# EasyEDA Pro project ProProject_工科大.epro

# Schematic power
Create Date: 2023-09-27; Page Name: P1; Project Name: New Project_2023-07-11_20-16-29; Schematic Name: Schematic7; Update Date: 2023-09-27; Company: 嘉立创EDA; Page Size: A4; Version: V1.0
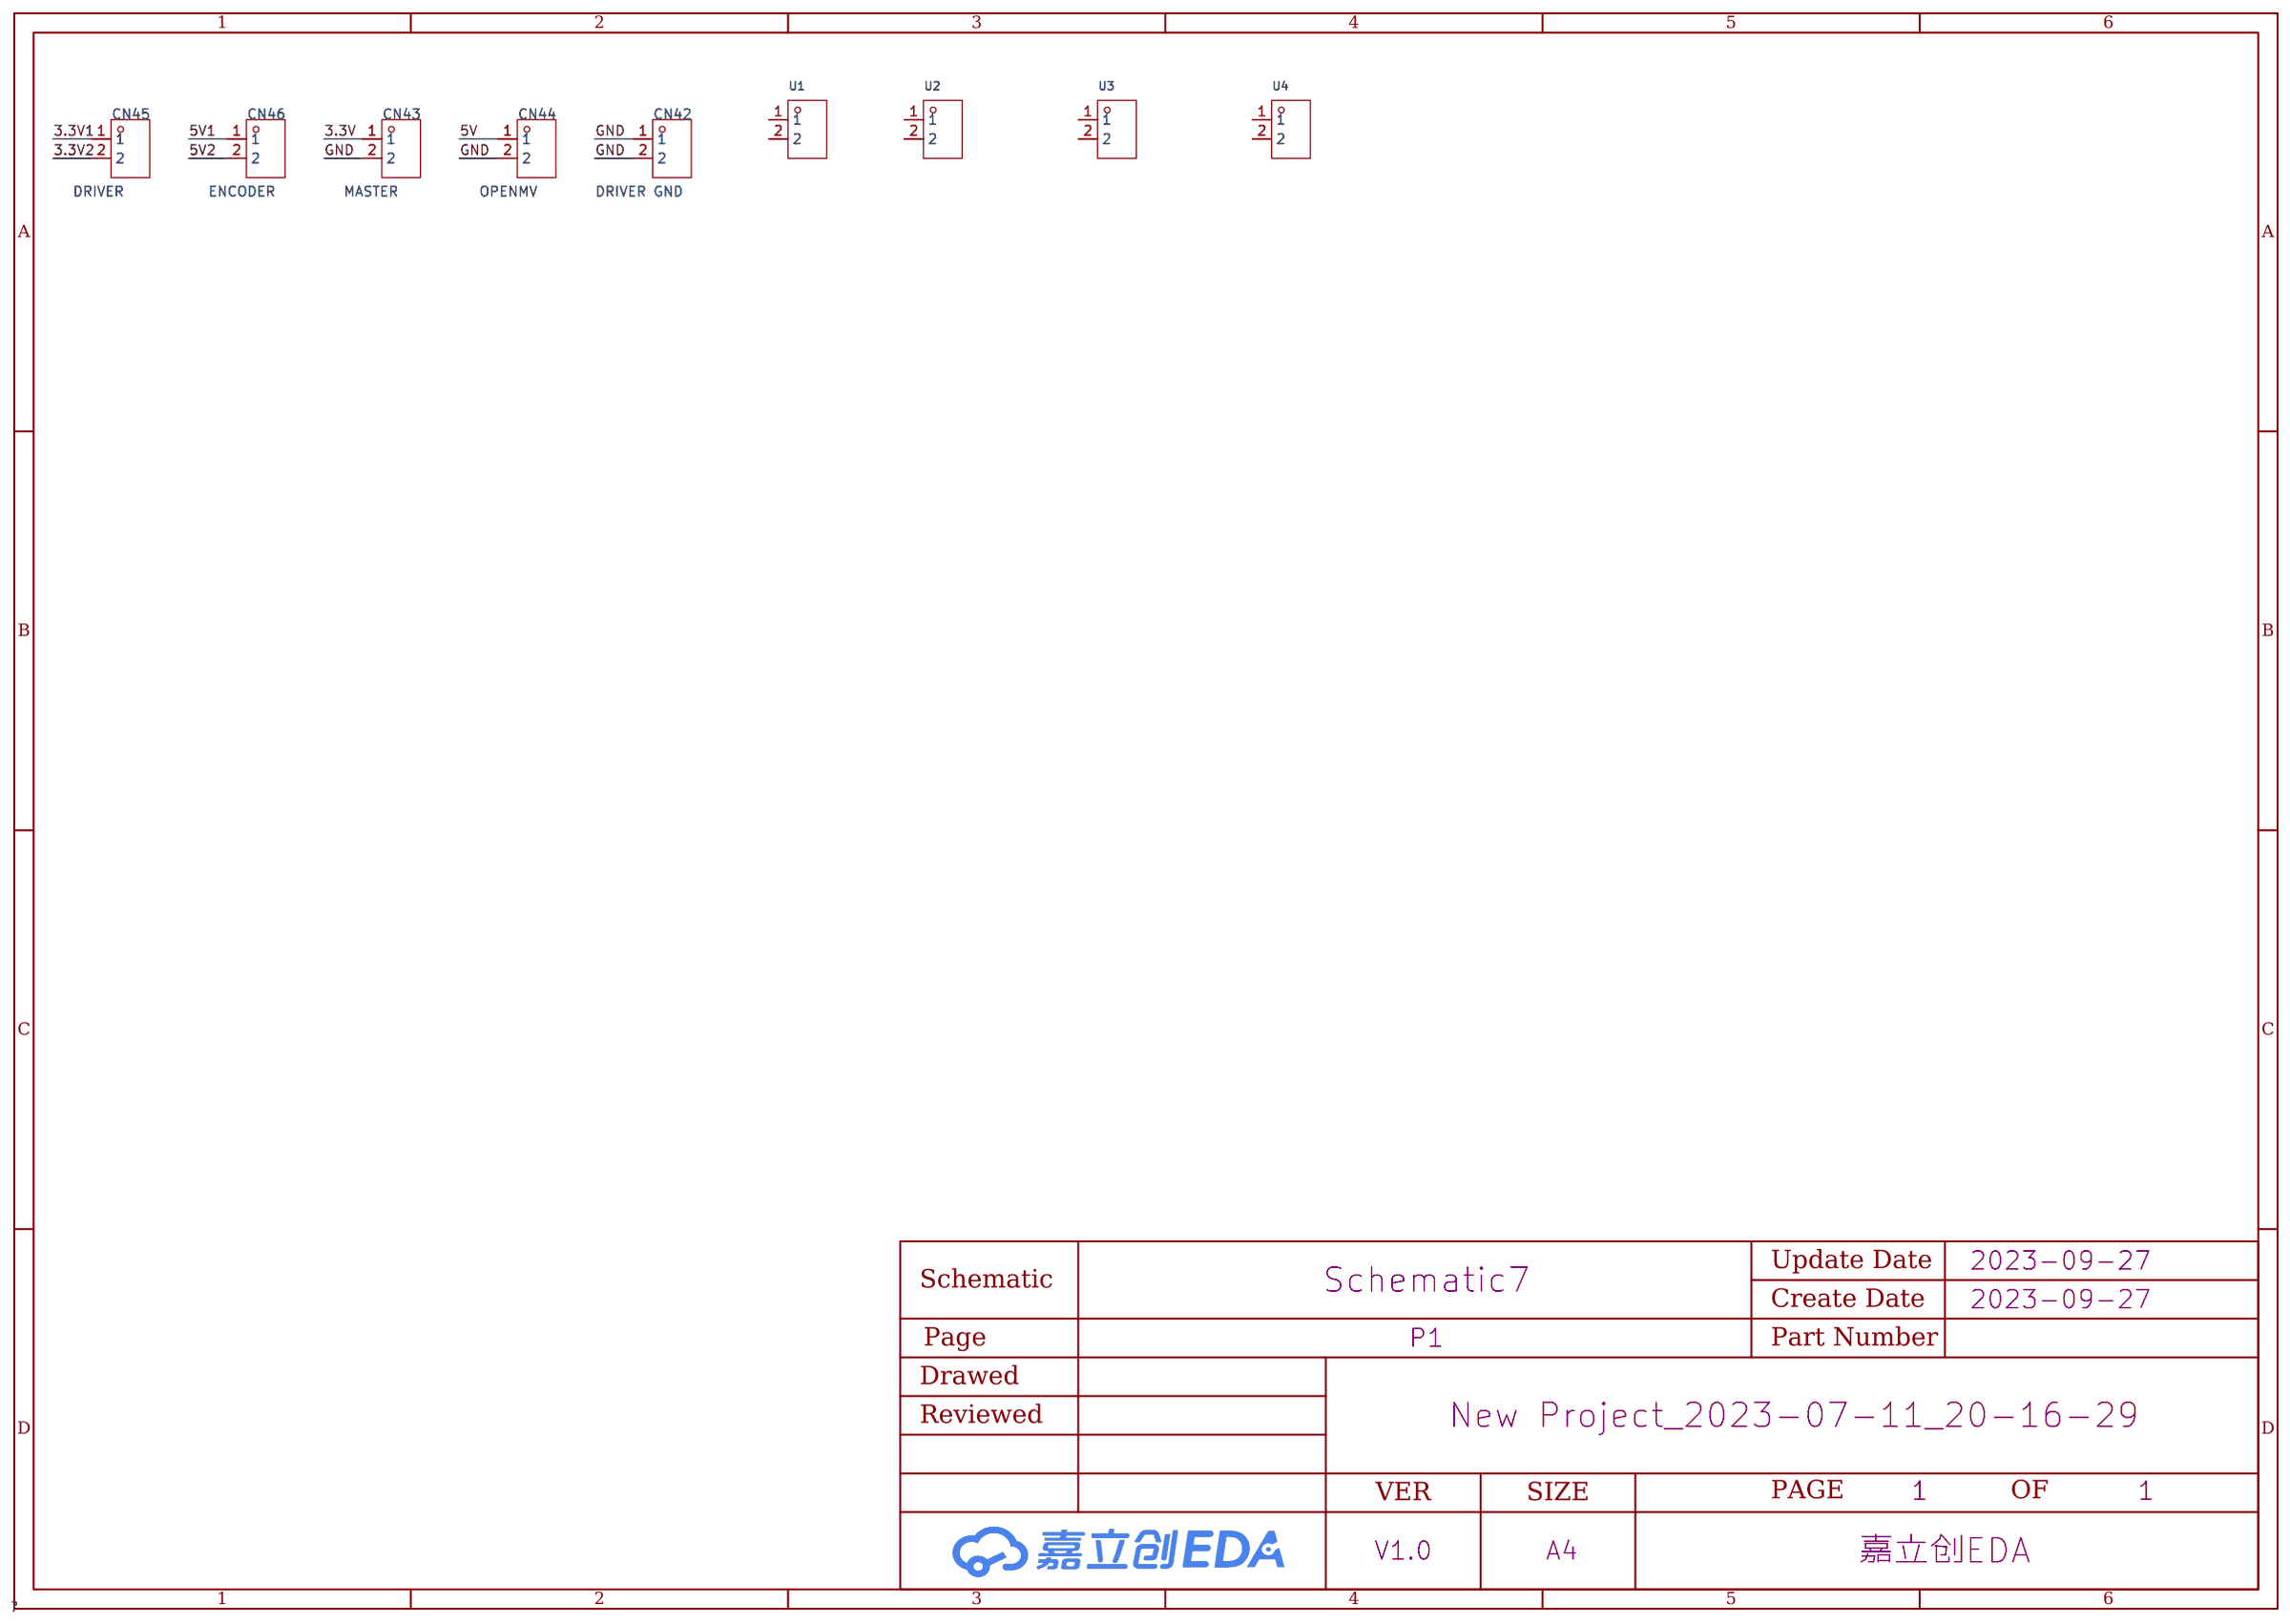
[diagram p0: schematic sheet]

## Parts
CN42  DRIVER GND  [CONN-TH_XH-2AW_C2908611]
CN43  MASTER  [CONN-TH_XH-2AW_C2908611]
CN44  OPENMV  [CONN-TH_XH-2AW_C2908611]
CN45  DRIVER  [CONN-TH_XH-2AW_C2908611]
CN46  ENCODER  [CONN-TH_XH-2AW_C2908611]
U1  PM254-1-02-Z-8.5  [HDR-TH_2P-P2.54-V-F]
U2  PM254-1-02-Z-8.5  [HDR-TH_2P-P2.54-V-F]
U3  PM254-1-02-Z-8.5  [HDR-TH_2P-P2.54-V-F]
U4  PM254-1-02-Z-8.5  [HDR-TH_2P-P2.54-V-F]

## Library data of the parts
CN42-CN46 = XH-2AW_C2908611: 参考系列:XH;间距:2.54mm;插针结构:1x2P;排数:1;每排PIN数:2;行距:-;公母:公型插针;安装方式:弯插;额定电流:3A;工作温度范围:-25℃~+85℃;; LCSC Part Name: XH 2.54mm 1x2P 弯插; Supplier Part: C2908611; Manufacturer: HCTL(华灿天禄); Supplier Footprint: 弯插,P=2.54mm; JLCPCB Part Class: 扩展库; Datasheet: https://atta.szlcsc.com/upload/public/pdf/source/20211021/ACA2D54D99493880102FCACAC8DAABA8.pdf; Supplier: LCSC; Reference Series: XH; Pitch: 2.54mm; Pins Structure: 1x2P; Number of Rows: 1; Number of PINs Per Row: 2; Gender: 公型插针; Mounting Style: 弯插; Current Rating (Max): 3A; Operating Temperature Range: -25℃~+85℃
U1-U4 = PM254-1-02-Z-8.5: 排数:单排;总孔位数:2P;间距:2.54mm;插孔结构:1x2P;行距:-;安装类型:直插;圆孔/方孔:方孔;额定电流:3A;额定电压:-;插孔方向:顶部;塑高:8.5mm;工作温度范围:-40℃~+105℃;; LCSC Part Name: 2.54mm 1x2P; Supplier Part: C2897365; Manufacturer: HCTL(华灿天禄); Supplier Footprint: 插件,P=2.54mm; JLCPCB Part Class: 扩展库; Datasheet: https://atta.szlcsc.com/upload/public/pdf/source/20230609/534BE42964C679BDE98E061007C4ABD6.pdf; Supplier: LCSC; Number of Rows: 单排; Number of Holes: 2P; Pitch: 2.54mm; Holes Structure: 1x2P; Mounting Type: 直插; Circular Hole / Square Hole: 方孔; Current Rating (Max): 3A; Holes Direction: 顶部; Insulation Height: 8.5mm; Operating Temperature Range: -40℃~+105℃

## Nets
3.3V: CN43.1
3.3V1: CN45.1
3.3V2: CN45.2
5V: CN44.1
5V1: CN46.1
5V2: CN46.2
GND: CN42.1 CN42.2 CN43.2 CN44.2

Not connected (* = marked no-connect by the designer): U1 1 2; U2 1 2; U3 1 2; U4 1 2

# Schematic driver
Create Date: 2023-09-27; Page Name: P1; Project Name: New Project_2023-07-11_20-16-29; Schematic Name: Schematic6; Update Date: 2023-09-27; Company: 嘉立创EDA; Page Size: A4; Version: V1.0
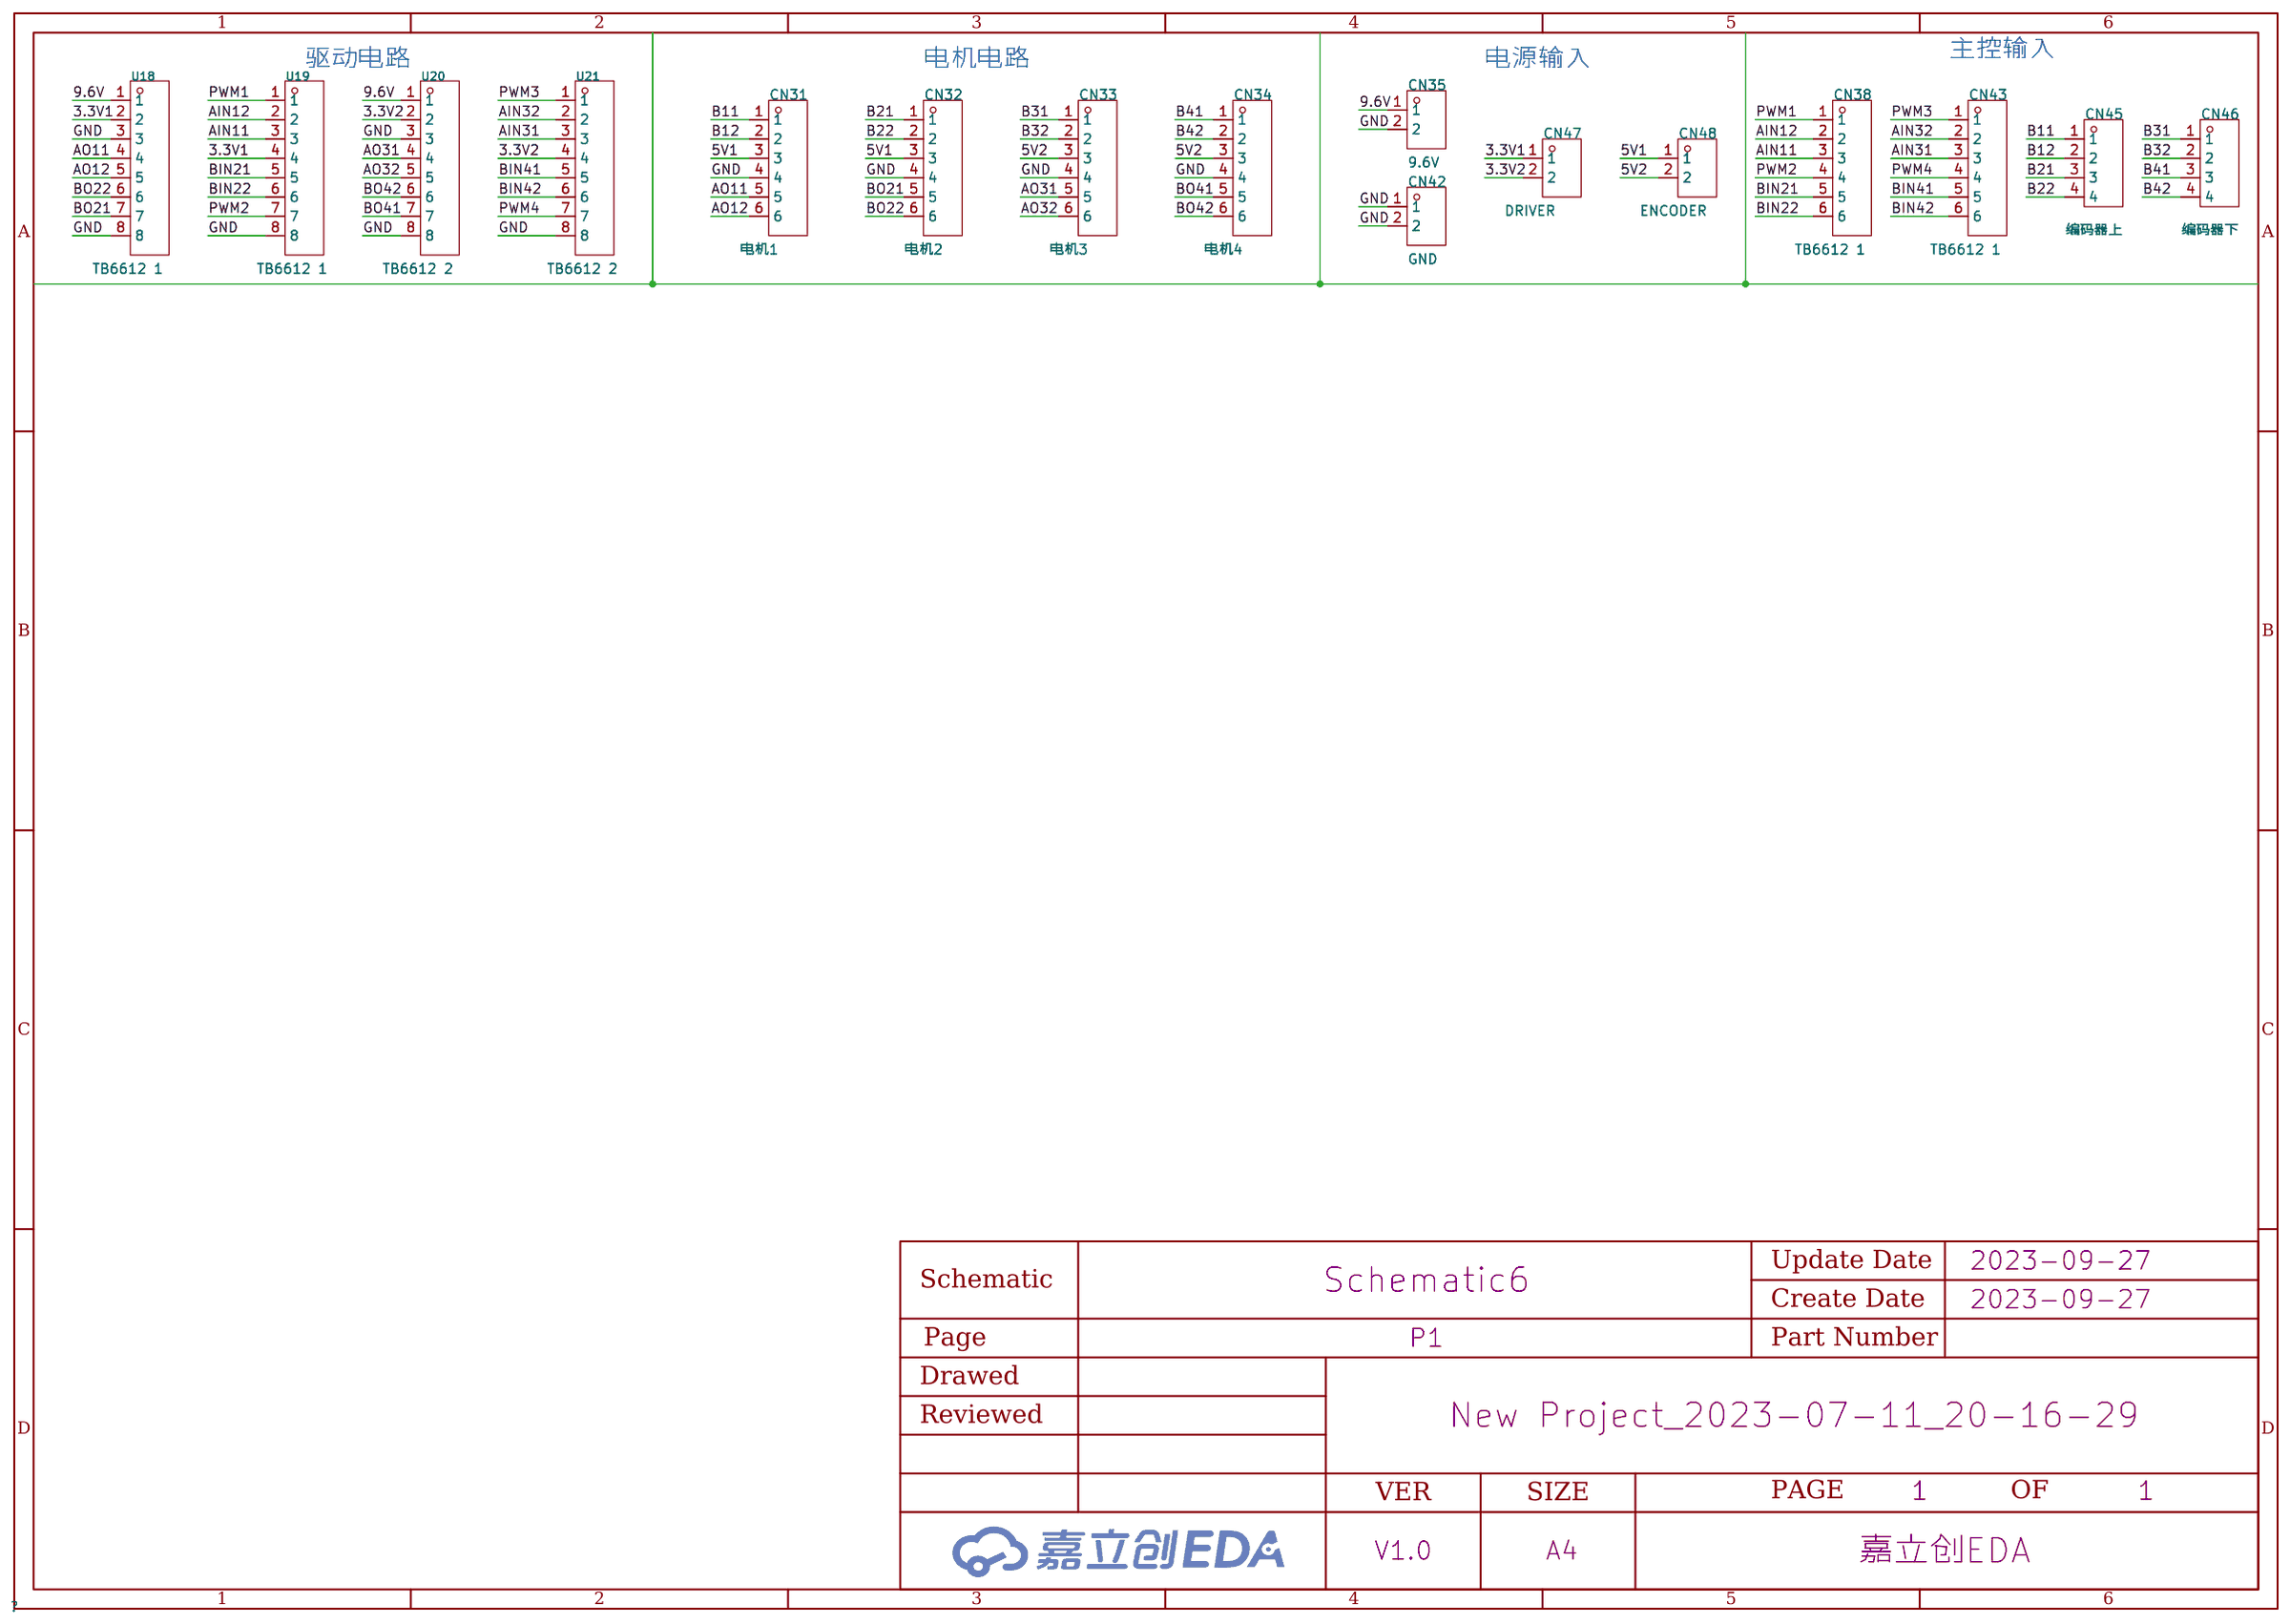
[diagram p1: schematic sheet]

## Parts
CN31  电机1  [CONN-TH_6P-P2.50_HC-XH-6AW-G]
CN32  电机2  [CONN-TH_6P-P2.50_HC-XH-6AW-G]
CN33  电机3  [CONN-TH_6P-P2.50_HC-XH-6AW-G]
CN34  电机4  [CONN-TH_6P-P2.50_HC-XH-6AW-G]
CN35  9.6V  [CONN-TH_XH-2AW_C2908611]
CN38  TB6612 1  [CONN-TH_6P-P2.50_HC-XH-6AW-G]
CN42  GND  [CONN-TH_XH-2AW_C2908611]
CN43  TB6612 1  [CONN-TH_6P-P2.50_HC-XH-6AW-G]
CN45  编码器上  [CONN-TH_XH-4AW]
CN46  编码器下  [CONN-TH_XH-4AW]
CN47  DRIVER  [CONN-TH_XH-2AW_C2908611]
CN48  ENCODER  [CONN-TH_XH-2AW_C2908611]
U18  TB6612 1  [HDR-TH_8P-P2.54-V-F]
U19  TB6612 1  [HDR-TH_8P-P2.54-V-F]
U20  TB6612 2  [HDR-TH_8P-P2.54-V-F]
U21  TB6612 2  [HDR-TH_8P-P2.54-V-F]

## Library data of the parts
CN31-CN34 CN38 CN43 = HC-XH-6AW-G: 参考系列:XH;间距:2.54mm;插针结构:1x6P;排数:1;每排PIN数:6;行距:2.54mm;公母:公型插针;安装方式:弯插;额定电流:3A;工作温度范围:-25℃~+85℃;; LCSC Part Name: XH 2.54mm 1x6P 弯插; Supplier Part: C5341212; Manufacturer: HCTL(华灿天禄); Supplier Footprint: 弯插,P=2.5mm; JLCPCB Part Class: 扩展库; Datasheet: https://atta.szlcsc.com/upload/public/pdf/source/20230105/4FFD2EFD3DA44AA828171A44400F3EDE.pdf; Supplier: LCSC; Reference Series: XH; Pitch: 2.54mm; Pins Structure: 1x6P; Number of Rows: 1; Number of PINs Per Row: 6; Row Spacing: 2.54mm; Gender: 公型插针; Mounting Style: 弯插; Current Rating (Max): 3A; Operating Temperature Range: -25℃~+85℃
CN35 CN42 CN47 CN48 = XH-2AW_C2908611: 参考系列:XH;间距:2.54mm;插针结构:1x2P;排数:1;每排PIN数:2;行距:-;公母:公型插针;安装方式:弯插;额定电流:3A;工作温度范围:-25℃~+85℃;; LCSC Part Name: XH 2.54mm 1x2P 弯插; Supplier Part: C2908611; Manufacturer: HCTL(华灿天禄); Supplier Footprint: 弯插,P=2.54mm; JLCPCB Part Class: 扩展库; Datasheet: https://atta.szlcsc.com/upload/public/pdf/source/20211021/ACA2D54D99493880102FCACAC8DAABA8.pdf; Supplier: LCSC; Reference Series: XH; Pitch: 2.54mm; Pins Structure: 1x2P; Number of Rows: 1; Number of PINs Per Row: 2; Gender: 公型插针; Mounting Style: 弯插; Current Rating (Max): 3A; Operating Temperature Range: -25℃~+85℃
CN45 CN46 = XH-4AW: 参考系列:XH;间距:2.54mm;插针结构:1x4P;排数:1;每排PIN数:4;行距:-;公母:公型插针;安装方式:弯插;额定电流:3A;工作温度范围:-25℃~+85℃;; LCSC Part Name: XH 2.54mm 1x4P 弯插; Supplier Part: C2908613; Manufacturer: HCTL(华灿天禄); Supplier Footprint: 插件,P=2.54mm; JLCPCB Part Class: 扩展库; Datasheet: https://atta.szlcsc.com/upload/public/pdf/source/20211021/ACA2D54D99493880102FCACAC8DAABA8.pdf; Supplier: LCSC; Reference Series: XH; Pitch: 2.54mm; Pins Structure: 1x4P; Number of Rows: 1; Number of PINs Per Row: 4; Gender: 公型插针; Mounting Style: 弯插; Current Rating (Max): 3A; Operating Temperature Range: -25℃~+85℃
U18-U21 = PM254-1-08-Z-8.5: 排数:单排;总孔位数:8P;间距:2.54mm;插孔结构:1x8P;行距:-;安装类型:直插;圆孔/方孔:方孔;额定电流:3A;额定电压:-;插孔方向:顶部;塑高:8.5mm;工作温度范围:-40℃~+105℃;; LCSC Part Name: 2.54mm 1x8P; Supplier Part: C2897371; Manufacturer: HCTL(华灿天禄); Supplier Footprint: 插件,P=2.54mm; JLCPCB Part Class: 扩展库; Datasheet: https://atta.szlcsc.com/upload/public/pdf/source/20230609/534BE42964C679BDE98E061007C4ABD6.pdf; Supplier: LCSC; Number of Rows: 单排; Number of Holes: 8P; Pitch: 2.54mm; Holes Structure: 1x8P; Mounting Type: 直插; Circular Hole / Square Hole: 方孔; Current Rating (Max): 3A; Holes Direction: 顶部; Insulation Height: 8.5mm; Operating Temperature Range: -40℃~+105℃

## Nets
3.3V1: CN47.1 U18.2 U19.4
3.3V2: CN47.2 U20.2 U21.4
5V1: CN31.3 CN32.3 CN48.1
5V2: CN33.3 CN34.3 CN48.2
9.6V: CN35.1 U18.1 U20.1
GND: CN31.4 CN32.4 CN33.4 CN34.4 CN35.2 CN42.1 CN42.2 U18.3 U18.8 U19.8 U20.3 U20.8 U21.8
AIN11: CN38.3 U19.3
AIN12: CN38.2 U19.2
AIN31: CN43.3 U21.3
AIN32: CN43.2 U21.2
AO11: CN31.5 U18.4
AO12: CN31.6 U18.5
AO31: CN33.5 U20.4
AO32: CN33.6 U20.5
B11: CN31.1 CN45.1
B12: CN31.2 CN45.2
B21: CN32.1 CN45.3
B22: CN32.2 CN45.4
B31: CN33.1 CN46.1
B32: CN33.2 CN46.2
B41: CN34.1 CN46.3
B42: CN34.2 CN46.4
BIN21: CN38.5 U19.5
BIN22: CN38.6 U19.6
BIN41: CN43.5 U21.5
BIN42: CN43.6 U21.6
BO21: CN32.5 U18.7
BO22: CN32.6 U18.6
BO41: CN34.5 U20.7
BO42: CN34.6 U20.6
PWM1: CN38.1 U19.1
PWM2: CN38.4 U19.7
PWM3: CN43.1 U21.1
PWM4: CN43.4 U21.7

## Notes on the sheet
- 主控输入
- 驱动电路
- 电机电路
- 电源输入

# Schematic master control
Create Date: 2023-09-27; Page Name: P1; Project Name: New Project_2023-07-11_20-16-29; Schematic Name: Schematic8; Update Date: 2023-09-27; Company: 嘉立创EDA; Page Size: A4; Version: V1.0
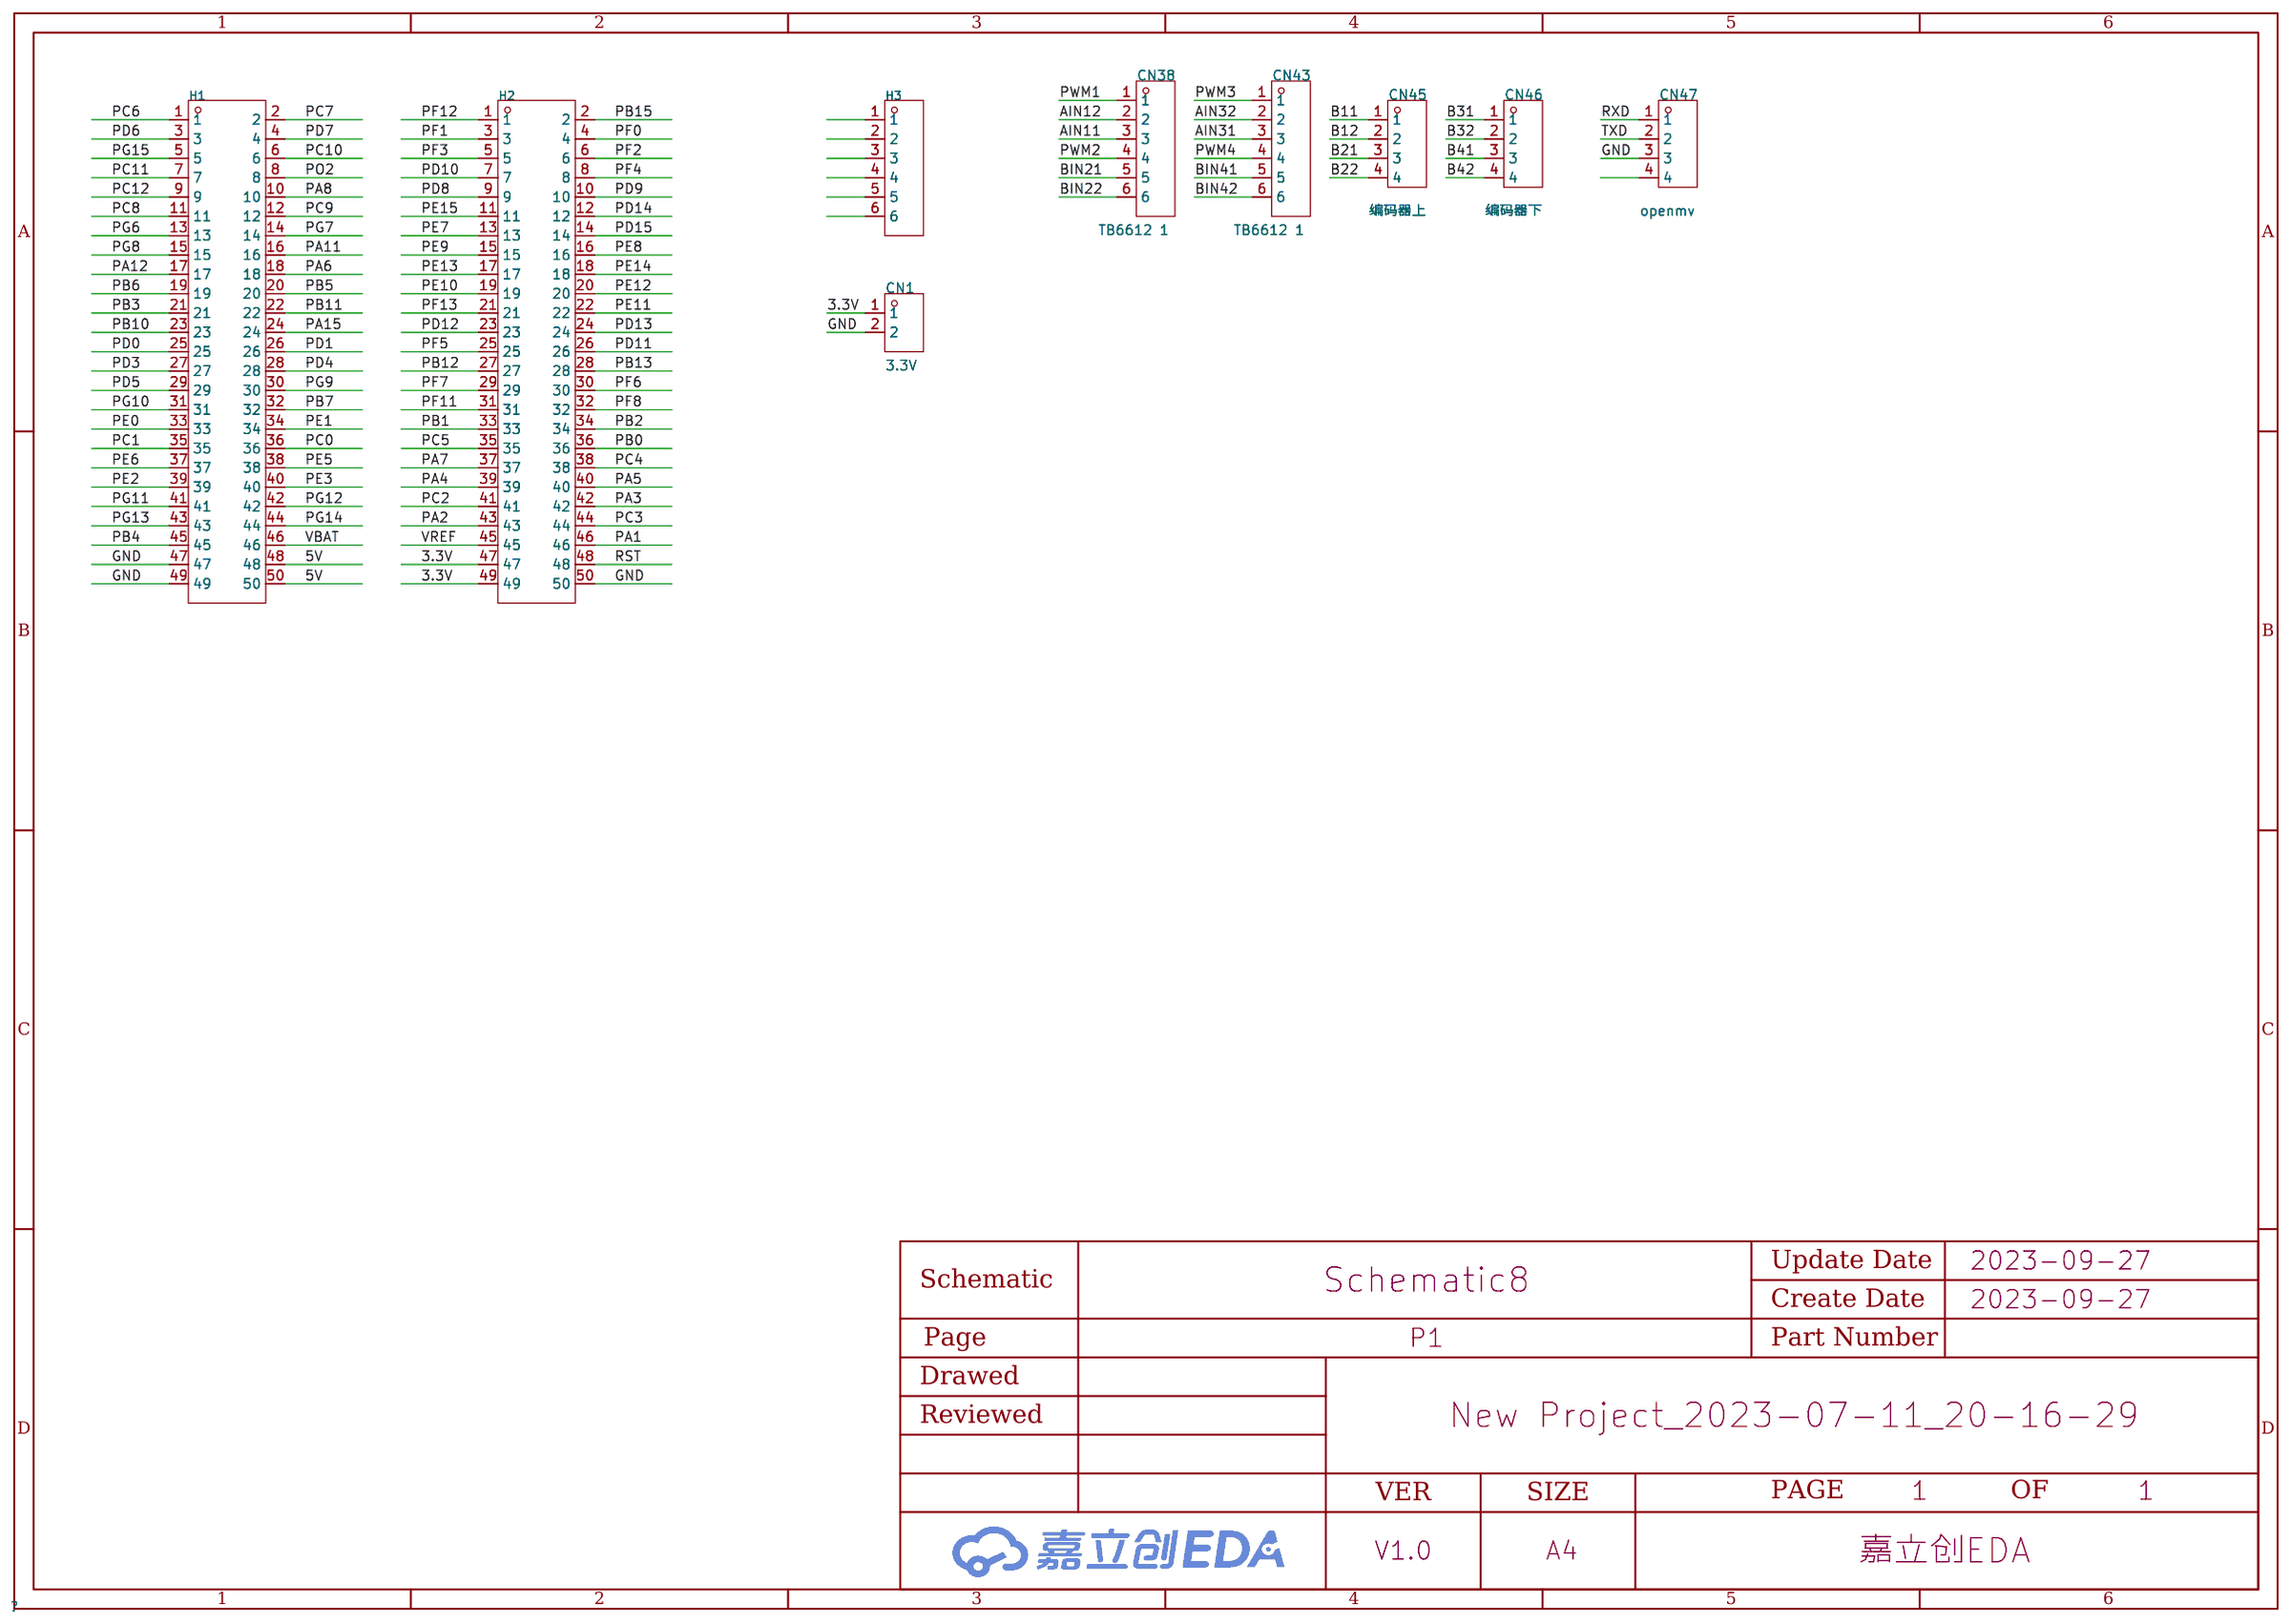
[diagram p2: schematic sheet]

## Parts
CN1  3.3V  [CONN-TH_XH-2AW_C2908611]
CN38  TB6612 1  [CONN-TH_6P-P2.50_HC-XH-6AW-G]
CN43  TB6612 1  [CONN-TH_6P-P2.50_HC-XH-6AW-G]
CN45  编码器上  [CONN-TH_XH-4AW]
CN46  编码器下  [CONN-TH_XH-4AW]
CN47  openmv  [CONN-TH_XH-4AW]
H1  FH-00077  [HDR-TH_50P-P2.54-V-F-R2-C25-S2.54-1]
H2  FH-00077  [HDR-TH_50P-P2.54-V-F-R2-C25-S2.54-1]
H3  PM254V-11-06-H85  [HDR-TH_6P-P2.54-V-F]

## Library data of the parts
CN1 = XH-2AW_C2908611: 参考系列:XH;间距:2.54mm;插针结构:1x2P;排数:1;每排PIN数:2;行距:-;公母:公型插针;安装方式:弯插;额定电流:3A;工作温度范围:-25℃~+85℃;; LCSC Part Name: XH 2.54mm 1x2P 弯插; Supplier Part: C2908611; Manufacturer: HCTL(华灿天禄); Supplier Footprint: 弯插,P=2.54mm; JLCPCB Part Class: 扩展库; Datasheet: https://atta.szlcsc.com/upload/public/pdf/source/20211021/ACA2D54D99493880102FCACAC8DAABA8.pdf; Supplier: LCSC; Reference Series: XH; Pitch: 2.54mm; Pins Structure: 1x2P; Number of Rows: 1; Number of PINs Per Row: 2; Gender: 公型插针; Mounting Style: 弯插; Current Rating (Max): 3A; Operating Temperature Range: -25℃~+85℃
CN38 CN43 = HC-XH-6AW-G: 参考系列:XH;间距:2.54mm;插针结构:1x6P;排数:1;每排PIN数:6;行距:2.54mm;公母:公型插针;安装方式:弯插;额定电流:3A;工作温度范围:-25℃~+85℃;; LCSC Part Name: XH 2.54mm 1x6P 弯插; Supplier Part: C5341212; Manufacturer: HCTL(华灿天禄); Supplier Footprint: 弯插,P=2.5mm; JLCPCB Part Class: 扩展库; Datasheet: https://atta.szlcsc.com/upload/public/pdf/source/20230105/4FFD2EFD3DA44AA828171A44400F3EDE.pdf; Supplier: LCSC; Reference Series: XH; Pitch: 2.54mm; Pins Structure: 1x6P; Number of Rows: 1; Number of PINs Per Row: 6; Row Spacing: 2.54mm; Gender: 公型插针; Mounting Style: 弯插; Current Rating (Max): 3A; Operating Temperature Range: -25℃~+85℃
CN45-CN47 = XH-4AW: 参考系列:XH;间距:2.54mm;插针结构:1x4P;排数:1;每排PIN数:4;行距:-;公母:公型插针;安装方式:弯插;额定电流:3A;工作温度范围:-25℃~+85℃;; LCSC Part Name: XH 2.54mm 1x4P 弯插; Supplier Part: C2908613; Manufacturer: HCTL(华灿天禄); Supplier Footprint: 插件,P=2.54mm; JLCPCB Part Class: 扩展库; Datasheet: https://atta.szlcsc.com/upload/public/pdf/source/20211021/ACA2D54D99493880102FCACAC8DAABA8.pdf; Supplier: LCSC; Reference Series: XH; Pitch: 2.54mm; Pins Structure: 1x4P; Number of Rows: 1; Number of PINs Per Row: 4; Gender: 公型插针; Mounting Style: 弯插; Current Rating (Max): 3A; Operating Temperature Range: -25℃~+85℃
H1 H2 = FH-00077: 排数:双排;总孔位数:50;间距:2.54mm;插孔结构:2x25P;行距:2.54mm;安装类型:直插;圆孔/方孔:方孔;额定电流:3A;额定电压:-;插孔方向:顶部;塑高:8.5mm;触头材质:黄铜;触头镀层:金;工作温度范围:-40℃~+105℃;焊接温度(最大值):200℃@10S;; LCSC Part Name: 2.54mm 2x25P; Supplier Part: C2829906; Manufacturer: Liansheng(连盛); Supplier Footprint: 直插,P=2.54mm; JLCPCB Part Class: 扩展库; Supplier: LCSC; Number of Rows: 双排; Number of Holes: 50; Pitch: 2.54mm; Holes Structure: 2x25P; Row Spacing: 2.54mm; Mounting Type: 直插; Circular Hole / Square Hole: 方孔; Current Rating (Max): 3A; Holes Direction: 顶部; Insulation Height: 8.5mm; Contact Material: 黄铜; Contact Plating: 金; Operating Temperature Range: -40℃~+105℃; Welding Temperature (Max): 200℃@10S
H3 = PM254V-11-06-H85: 排数:单排;总孔位数:6P;间距:2.54mm;插孔结构:1x6P;行距:-;安装类型:直插;圆孔/方孔:方孔;额定电流:3A;额定电压:250V;插孔方向:顶部;塑高:-;工作温度范围:-40℃~+105℃;; LCSC Part Name: 2.54mm 1x6P; Supplier Part: C2832269; Manufacturer: XFCN(兴飞); Supplier Footprint: 插件,P=2.54mm; JLCPCB Part Class: 扩展库; Datasheet: https://atta.szlcsc.com/upload/public/pdf/source/20210514/C2832269_B3EC97736B37C2783BDCE3050AA57447.pdf; Supplier: LCSC; Number of Rows: 单排; Number of Holes: 6P; Pitch: 2.54mm; Holes Structure: 1x6P; Mounting Type: 直插; Circular Hole / Square Hole: 方孔; Current Rating (Max): 3A; Voltage Rating (Max): 250V; Holes Direction: 顶部; Operating Temperature Range: -40℃~+105℃

## Nets
3.3V: CN1.1 H2.47 H2.49
5V: H1.48 H1.50
GND: CN1.2 CN47.3 H1.47 H1.49 H2.50
VBAT: H1.46
AIN11: CN38.3
AIN12: CN38.2
AIN31: CN43.3
AIN32: CN43.2
B11: CN45.1
B12: CN45.2
B21: CN45.3
B22: CN45.4
B31: CN46.1
B32: CN46.2
B41: CN46.3
B42: CN46.4
BIN21: CN38.5
BIN22: CN38.6
BIN41: CN43.5
BIN42: CN43.6
PA1: H2.46
PA2: H2.43
PA3: H2.42
PA4: H2.39
PA5: H2.40
PA6: H1.18
PA7: H2.37
PA8: H1.10
PA11: H1.16
PA12: H1.17
PA15: H1.24
PB0: H2.36
PB1: H2.33
PB2: H2.34
PB3: H1.21
PB4: H1.45
PB5: H1.20
PB6: H1.19
PB7: H1.32
PB10: H1.23
PB11: H1.22
PB12: H2.27
PB13: H2.28
PB15: H2.2
PC0: H1.36
PC1: H1.35
PC2: H2.41
PC3: H2.44
PC4: H2.38
PC5: H2.35
PC6: H1.1
PC7: H1.2
PC8: H1.11
PC9: H1.12
PC10: H1.6
PC11: H1.7
PC12: H1.9
PD0: H1.25
PD1: H1.26
PD3: H1.27
PD4: H1.28
PD5: H1.29
PD6: H1.3
PD7: H1.4
PD8: H2.9
PD9: H2.10
PD10: H2.7
PD11: H2.26
PD12: H2.23
PD13: H2.24
PD14: H2.12
PD15: H2.14
PE0: H1.33
PE1: H1.34
PE2: H1.39
PE3: H1.40
PE5: H1.38
PE6: H1.37
PE7: H2.13
PE8: H2.16
PE9: H2.15
PE10: H2.19
PE11: H2.22
PE12: H2.20
PE13: H2.17
PE14: H2.18
PE15: H2.11
PF0: H2.4
PF1: H2.3
PF2: H2.6
PF3: H2.5
PF4: H2.8
PF5: H2.25
PF6: H2.30
PF7: H2.29
PF8: H2.32
PF11: H2.31
PF12: H2.1
PF13: H2.21
PG6: H1.13
PG7: H1.14
PG8: H1.15
PG9: H1.30
PG10: H1.31
PG11: H1.41
PG12: H1.42
PG13: H1.43
PG14: H1.44
PG15: H1.5
PO2: H1.8
PWM1: CN38.1
PWM2: CN38.4
PWM3: CN43.1
PWM4: CN43.4
RST: H2.48
RXD: CN47.1
TXD: CN47.2
VREF: H2.45

Not connected (* = marked no-connect by the designer): CN47 4; H3 1 2 3 4 5 6

# Board master control
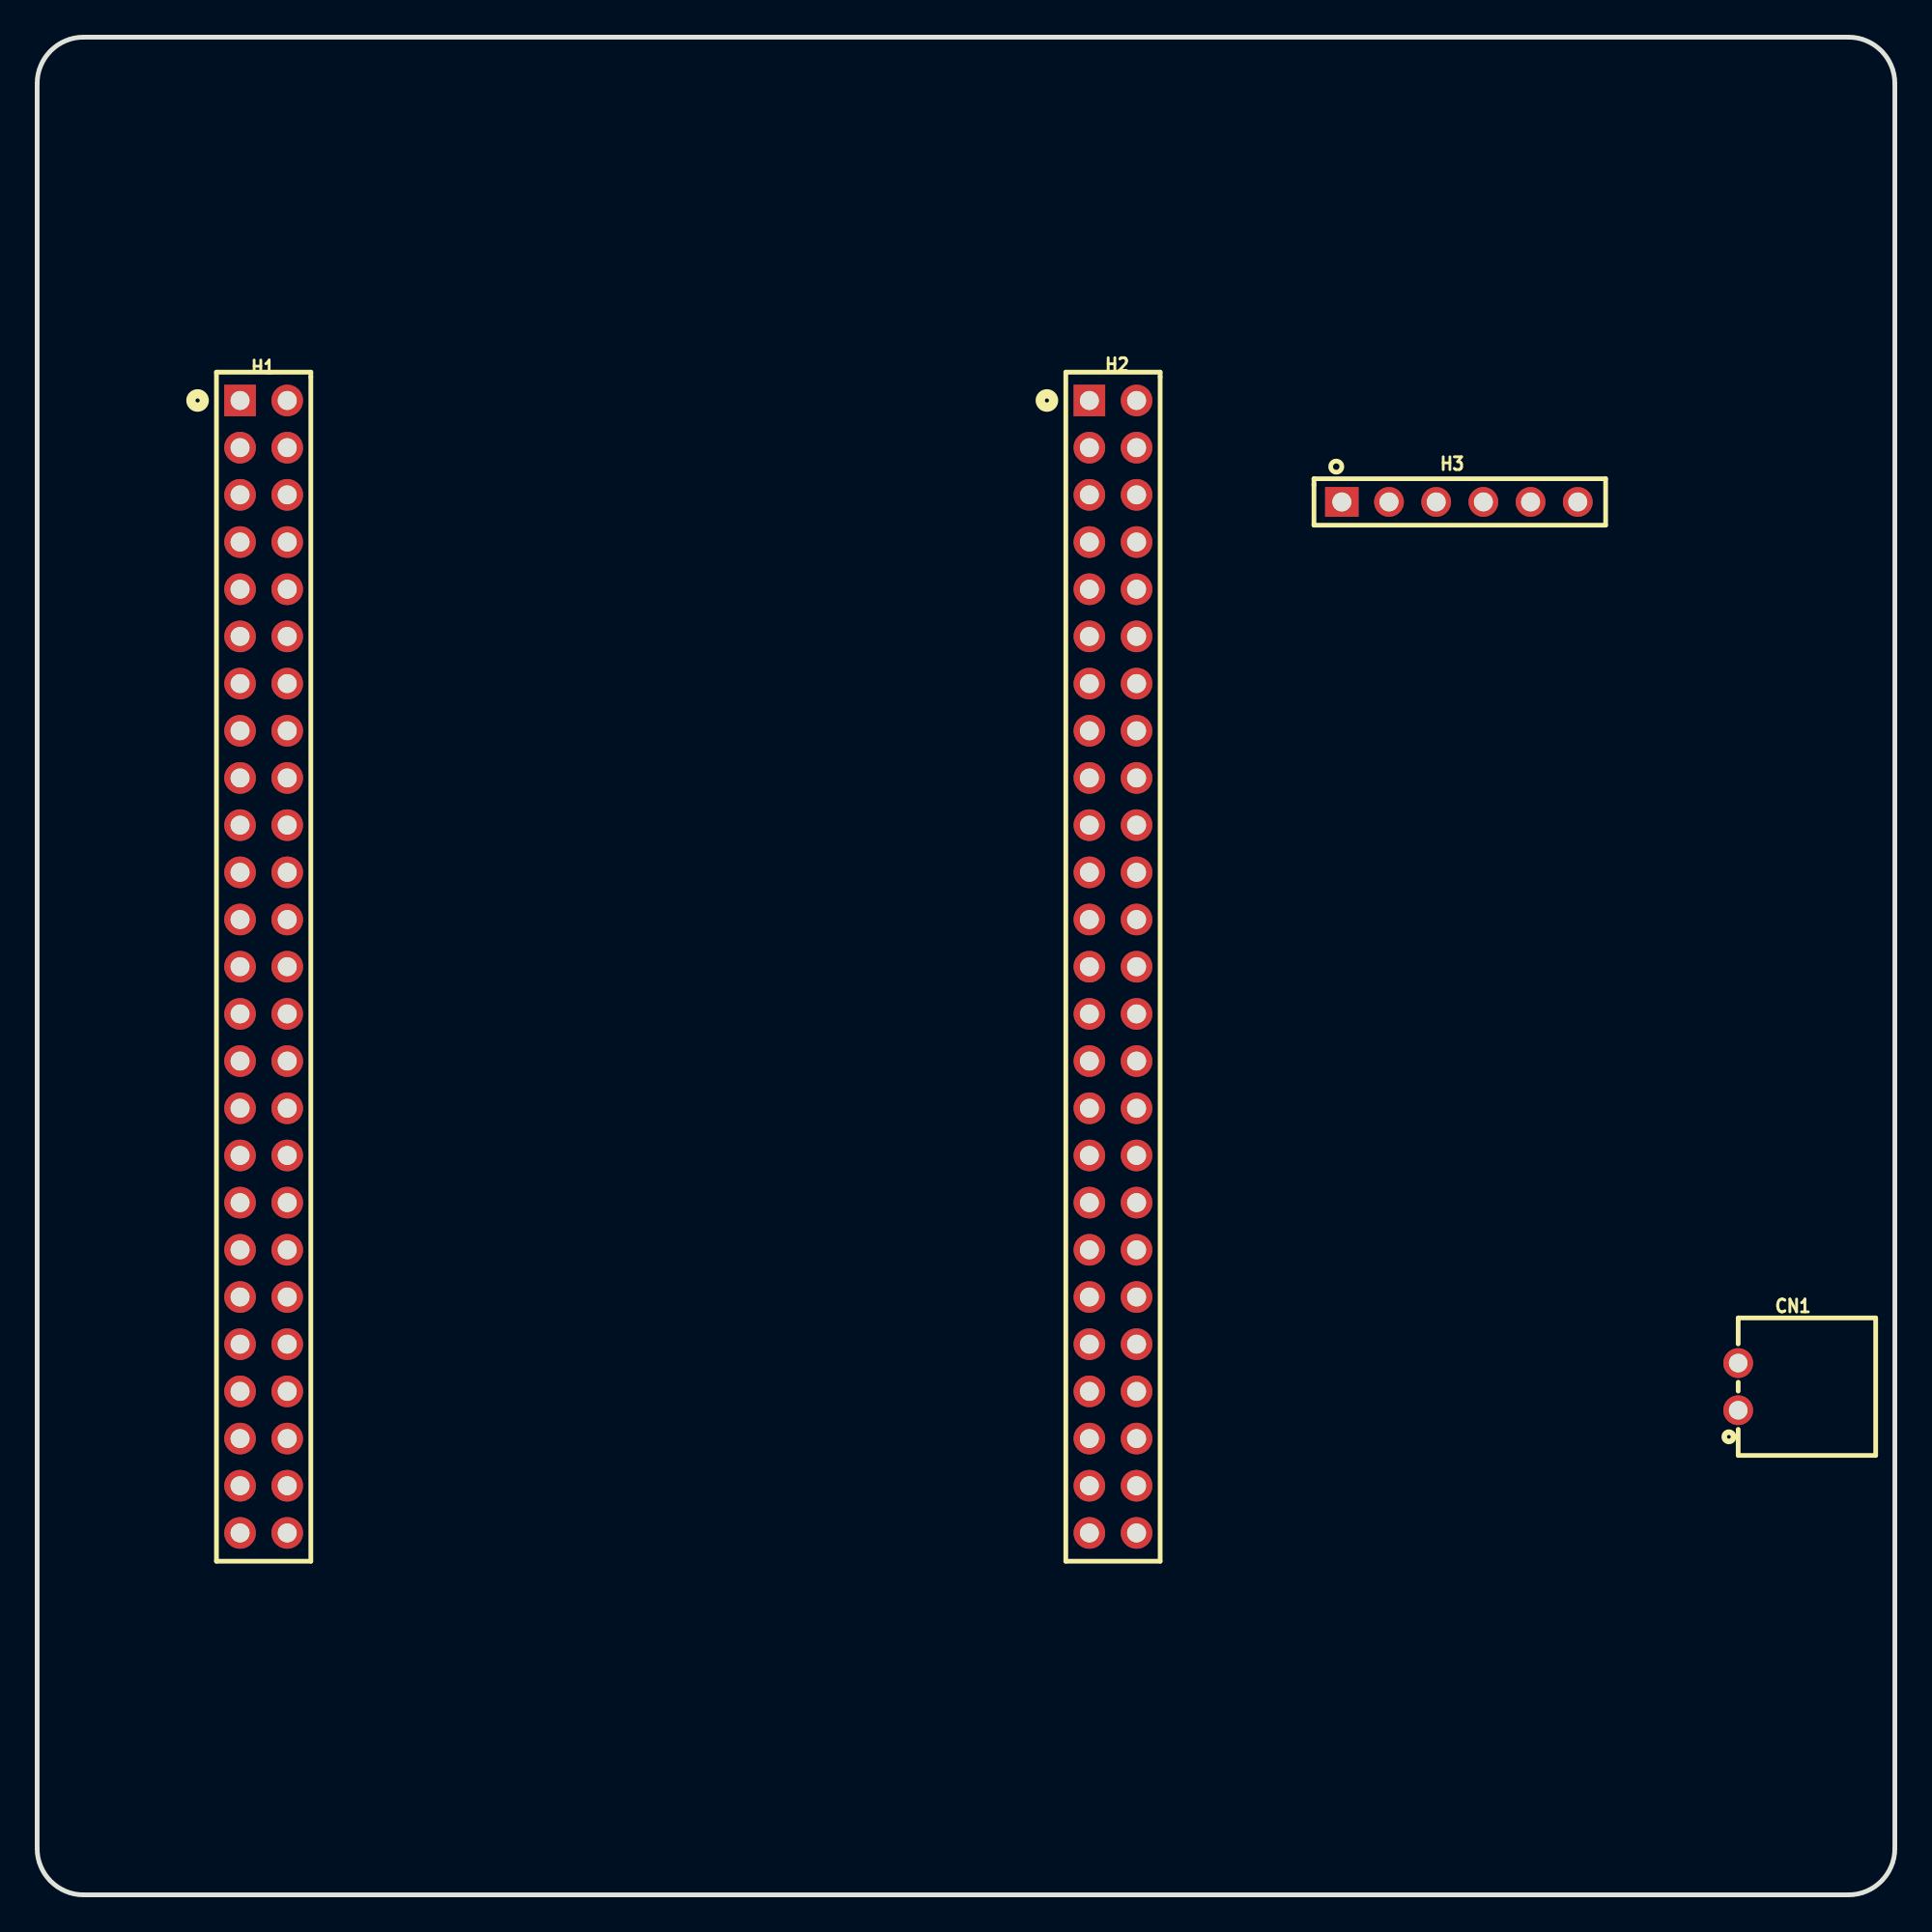
[diagram p3: board, top side]
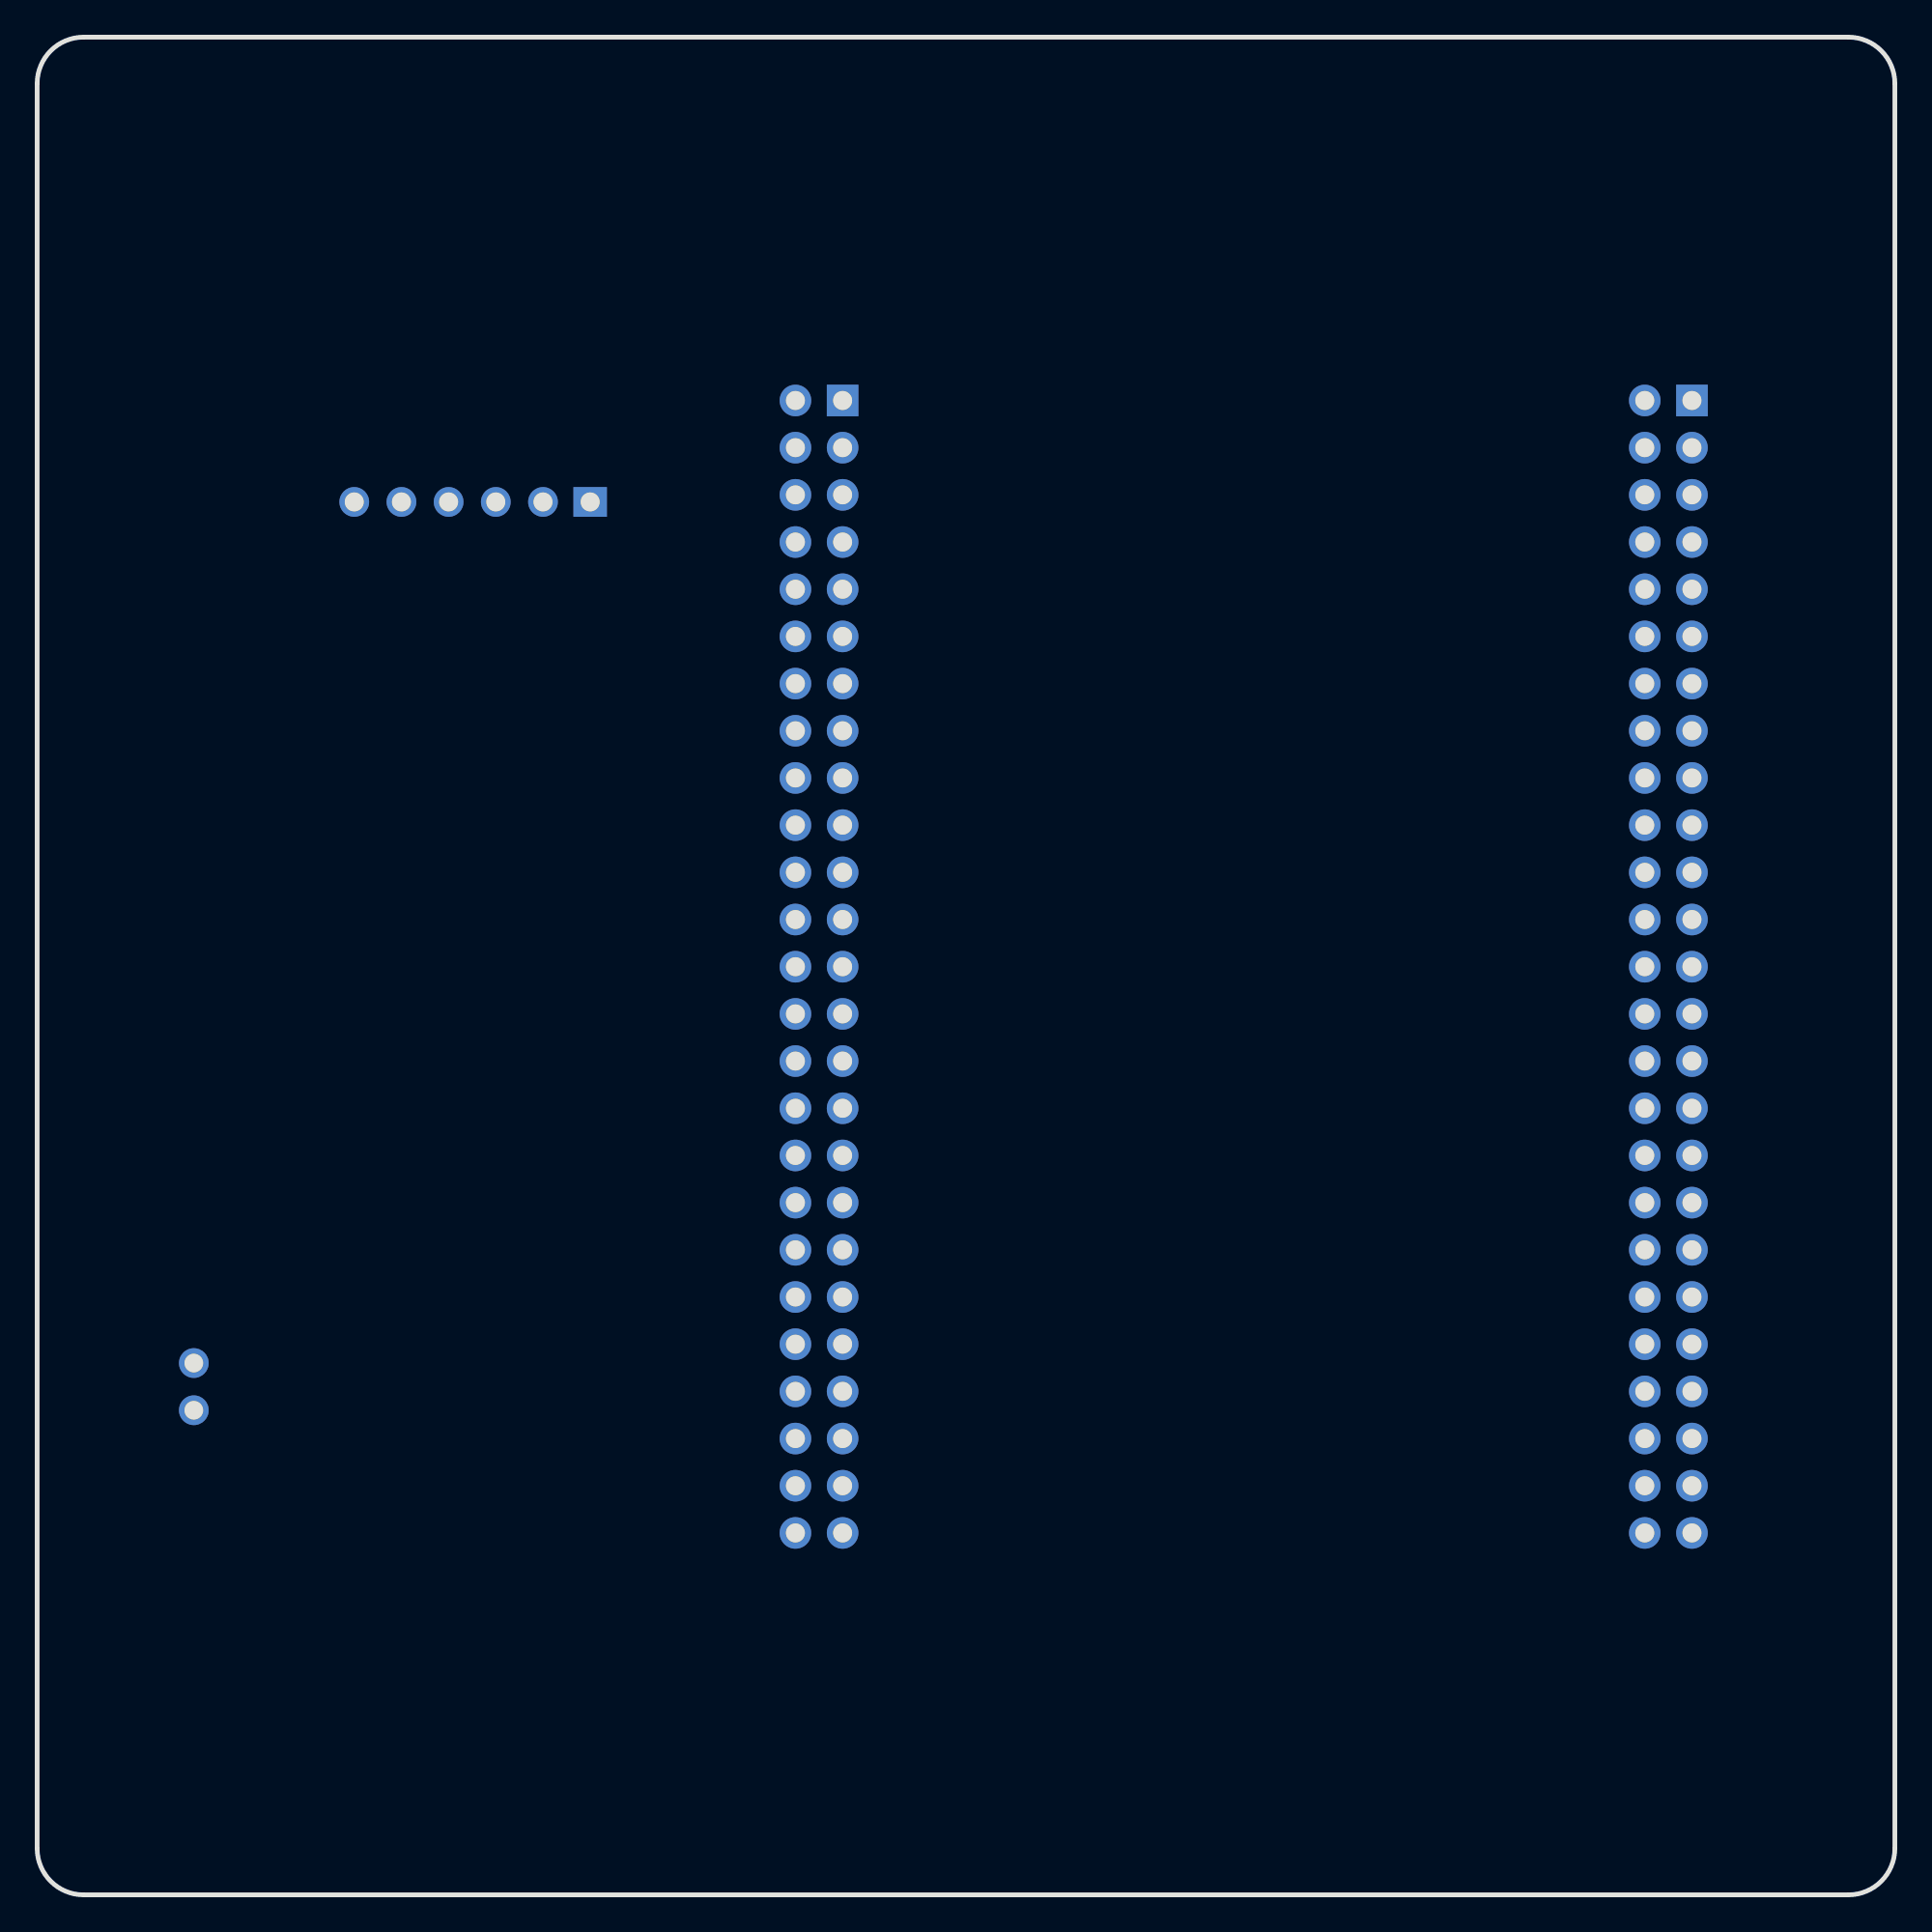
[diagram p4: board, bottom side, seen from below]

Outline 100 x 100 mm; copper layers: Top Layer, Inner9, Inner10, Inner11, Inner12, Inner13, Inner14, Inner15, Inner16, Inner17, Inner18, Inner19, Inner20, Inner21, Inner22, Inner23, Inner24, Inner25, Inner26, Inner27, Inner28, Inner29, Inner30, Bottom Layer. Coordinates in mm from the lower left corner of the outline.
Outline path: 0,97.5 0,2.5 arc(0.73,0.73) 2.5,0 97.5,0 arc(99.27,0.73) 100,2.5 100,97.5 arc(99.27,99.27) 97.5,100 2.5,100 arc(0.73,99.27) 0,97.5
Stack: Top Layer 0.035mm / Dielectric1 1.51mm FR4 er 4.5 / Bottom Layer 0.035mm

## Design rules (mm)
template: JLCPCB Capability(Two Layers Board)
spacing copperThickness1oz (default): track to track 0.102, other pairs 0.152 to 0.3
spacing copperThickness2oz: track to track 0.203, other pairs 0.152 to 0.3
track width copperThickness1oz (default): min 0.127, default 0.254, max 2.54
track width copperThickness2oz: min 0.203, default 0.254, max 2.54
differential pair differentialPair (default): width min 0.127, default 0.254, max 2.54; gap min 0.152, default 0.152
via viaSize (default): diameter min 0.5, default 0.61, max 10; hole min 0.3, default 0.305, max 6.3

## Placement (name value [footprint] x y rotation side)
CN1  3.3V  [CONN-TH_XH-2AW_C2908611]  91.57 27.36 90 top
H1  FH-00077  [HDR-TH_50P-P2.54-V-F-R2-C25-S2.54-1]  12.19 49.96 270 top
H2  FH-00077  [HDR-TH_50P-P2.54-V-F-R2-C25-S2.54-1]  57.91 49.96 270 top
H3  PM254V-11-06-H85  [HDR-TH_6P-P2.54-V-F]  76.58 74.98 0 top

## Footprints (pads in the part's own frame, mm; a bottom-side part is the same pattern mirrored in y, then rotated)
CONN-TH_XH-2AW_C2908611
  round 1.6 hole 1: 1(-1.27,0) 2(1.27,0)
HDR-TH_6P-P2.54-V-F
  rect 1.8x1.6 hole 1.02: 1(-6.35,0)
  round 1.6 hole 1.02: 2(-3.81,0) 3(-1.27,0) 4(1.27,0) 5(3.81,0) 6(6.35,0)
HDR-TH_50P-P2.54-V-F-R2-C25-S2.54-1
  rect 1.7x1.7 hole 1.02: 1(-30.48,-1.27)
  round 1.7 hole 1.02: 2(-30.48,1.27) 3(-27.94,-1.27) 4(-27.94,1.27) 5(-25.4,-1.27) 6(-25.4,1.27) 7(-22.86,-1.27) 8(-22.86,1.27) 9(-20.32,-1.27) 10(-20.32,1.27) 11(-17.78,-1.27) 12(-17.78,1.27) 13(-15.24,-1.27) 14(-15.24,1.27) 15(-12.7,-1.27) 16(-12.7,1.27) 17(-10.16,-1.27) 18(-10.16,1.27) 19(-7.62,-1.27) 20(-7.62,1.27) 21(-5.08,-1.27) 22(-5.08,1.27) 23(-2.54,-1.27) 24(-2.54,1.27) 25(0,-1.27) 26(0,1.27) 27(2.54,-1.27) 28(2.54,1.27) 29(5.08,-1.27) 30(5.08,1.27) 31(7.62,-1.27) 32(7.62,1.27) 33(10.16,-1.27) 34(10.16,1.27) 35(12.7,-1.27) 36(12.7,1.27) 37(15.24,-1.27) 38(15.24,1.27) 39(17.78,-1.27) 40(17.78,1.27) 41(20.32,-1.27) 42(20.32,1.27) 43(22.86,-1.27) 44(22.86,1.27) 45(25.4,-1.27) 46(25.4,1.27) 47(27.94,-1.27) 48(27.94,1.27) 49(30.48,-1.27) 50(30.48,1.27)

## Nets
As in the schematic, except:
3.3V: H2.47 H2.49
GND: H1.47 H1.49 H2.50

# Board driver
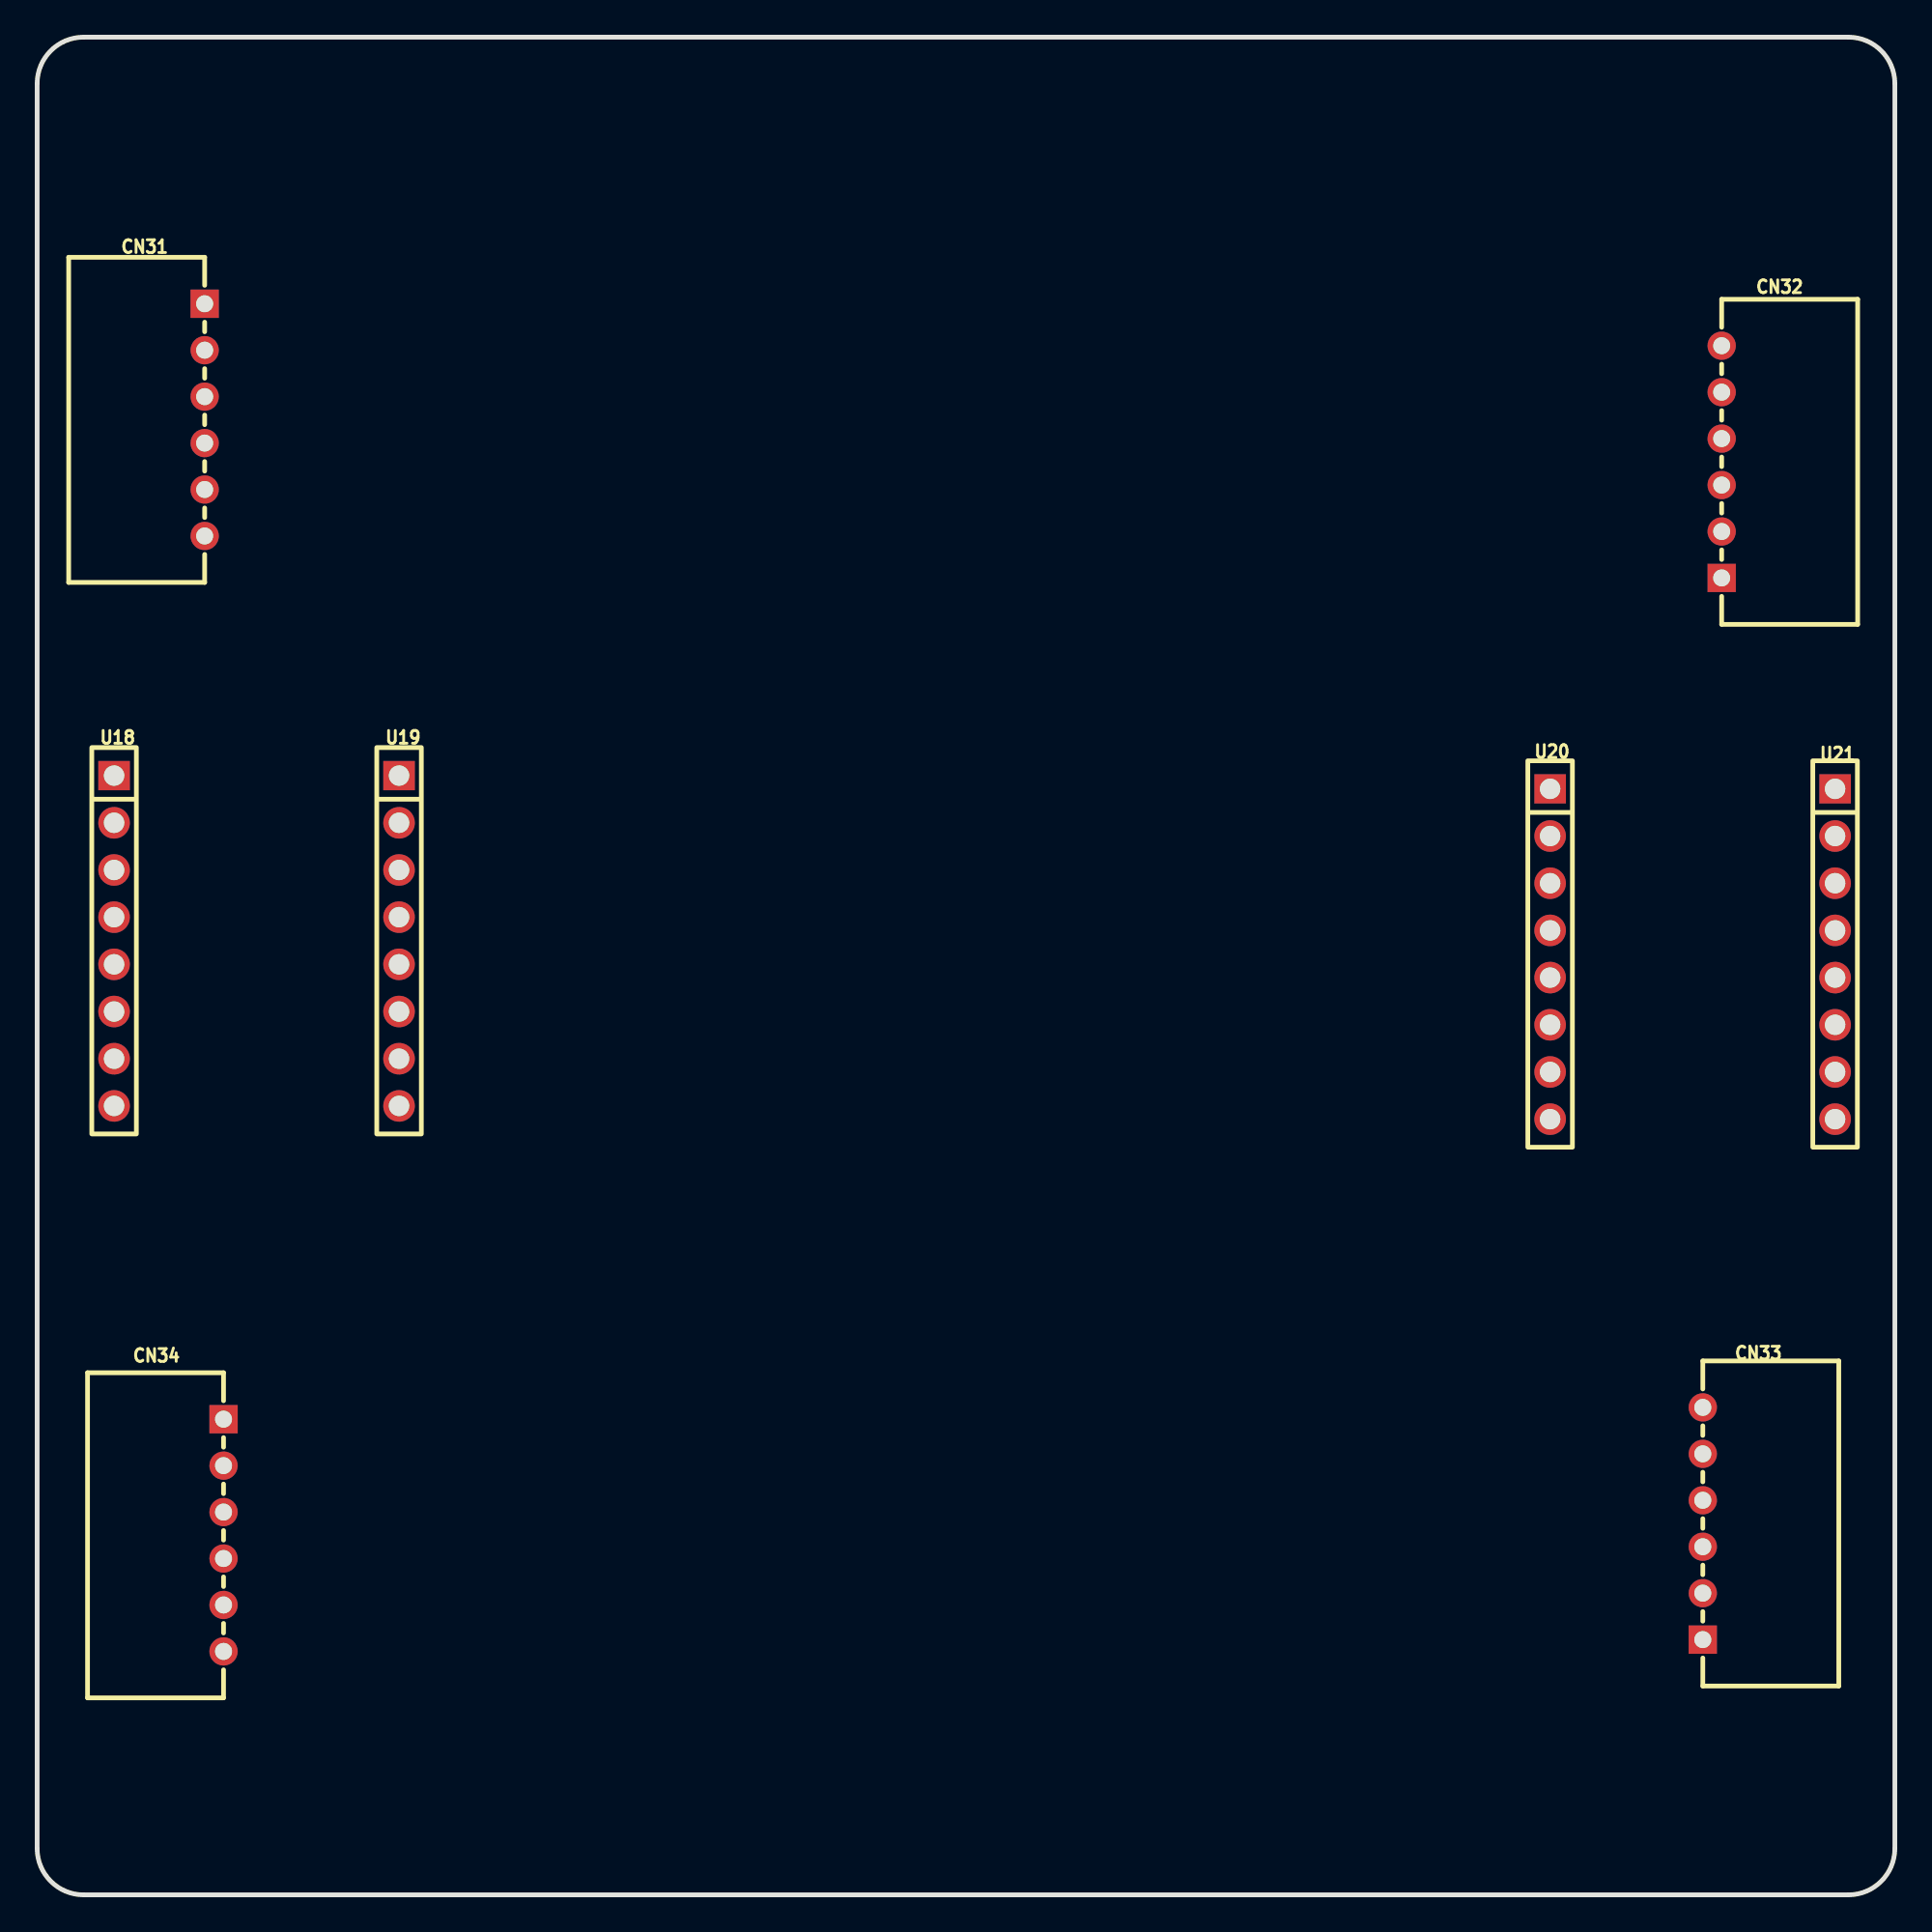
[diagram p5: board, top side]
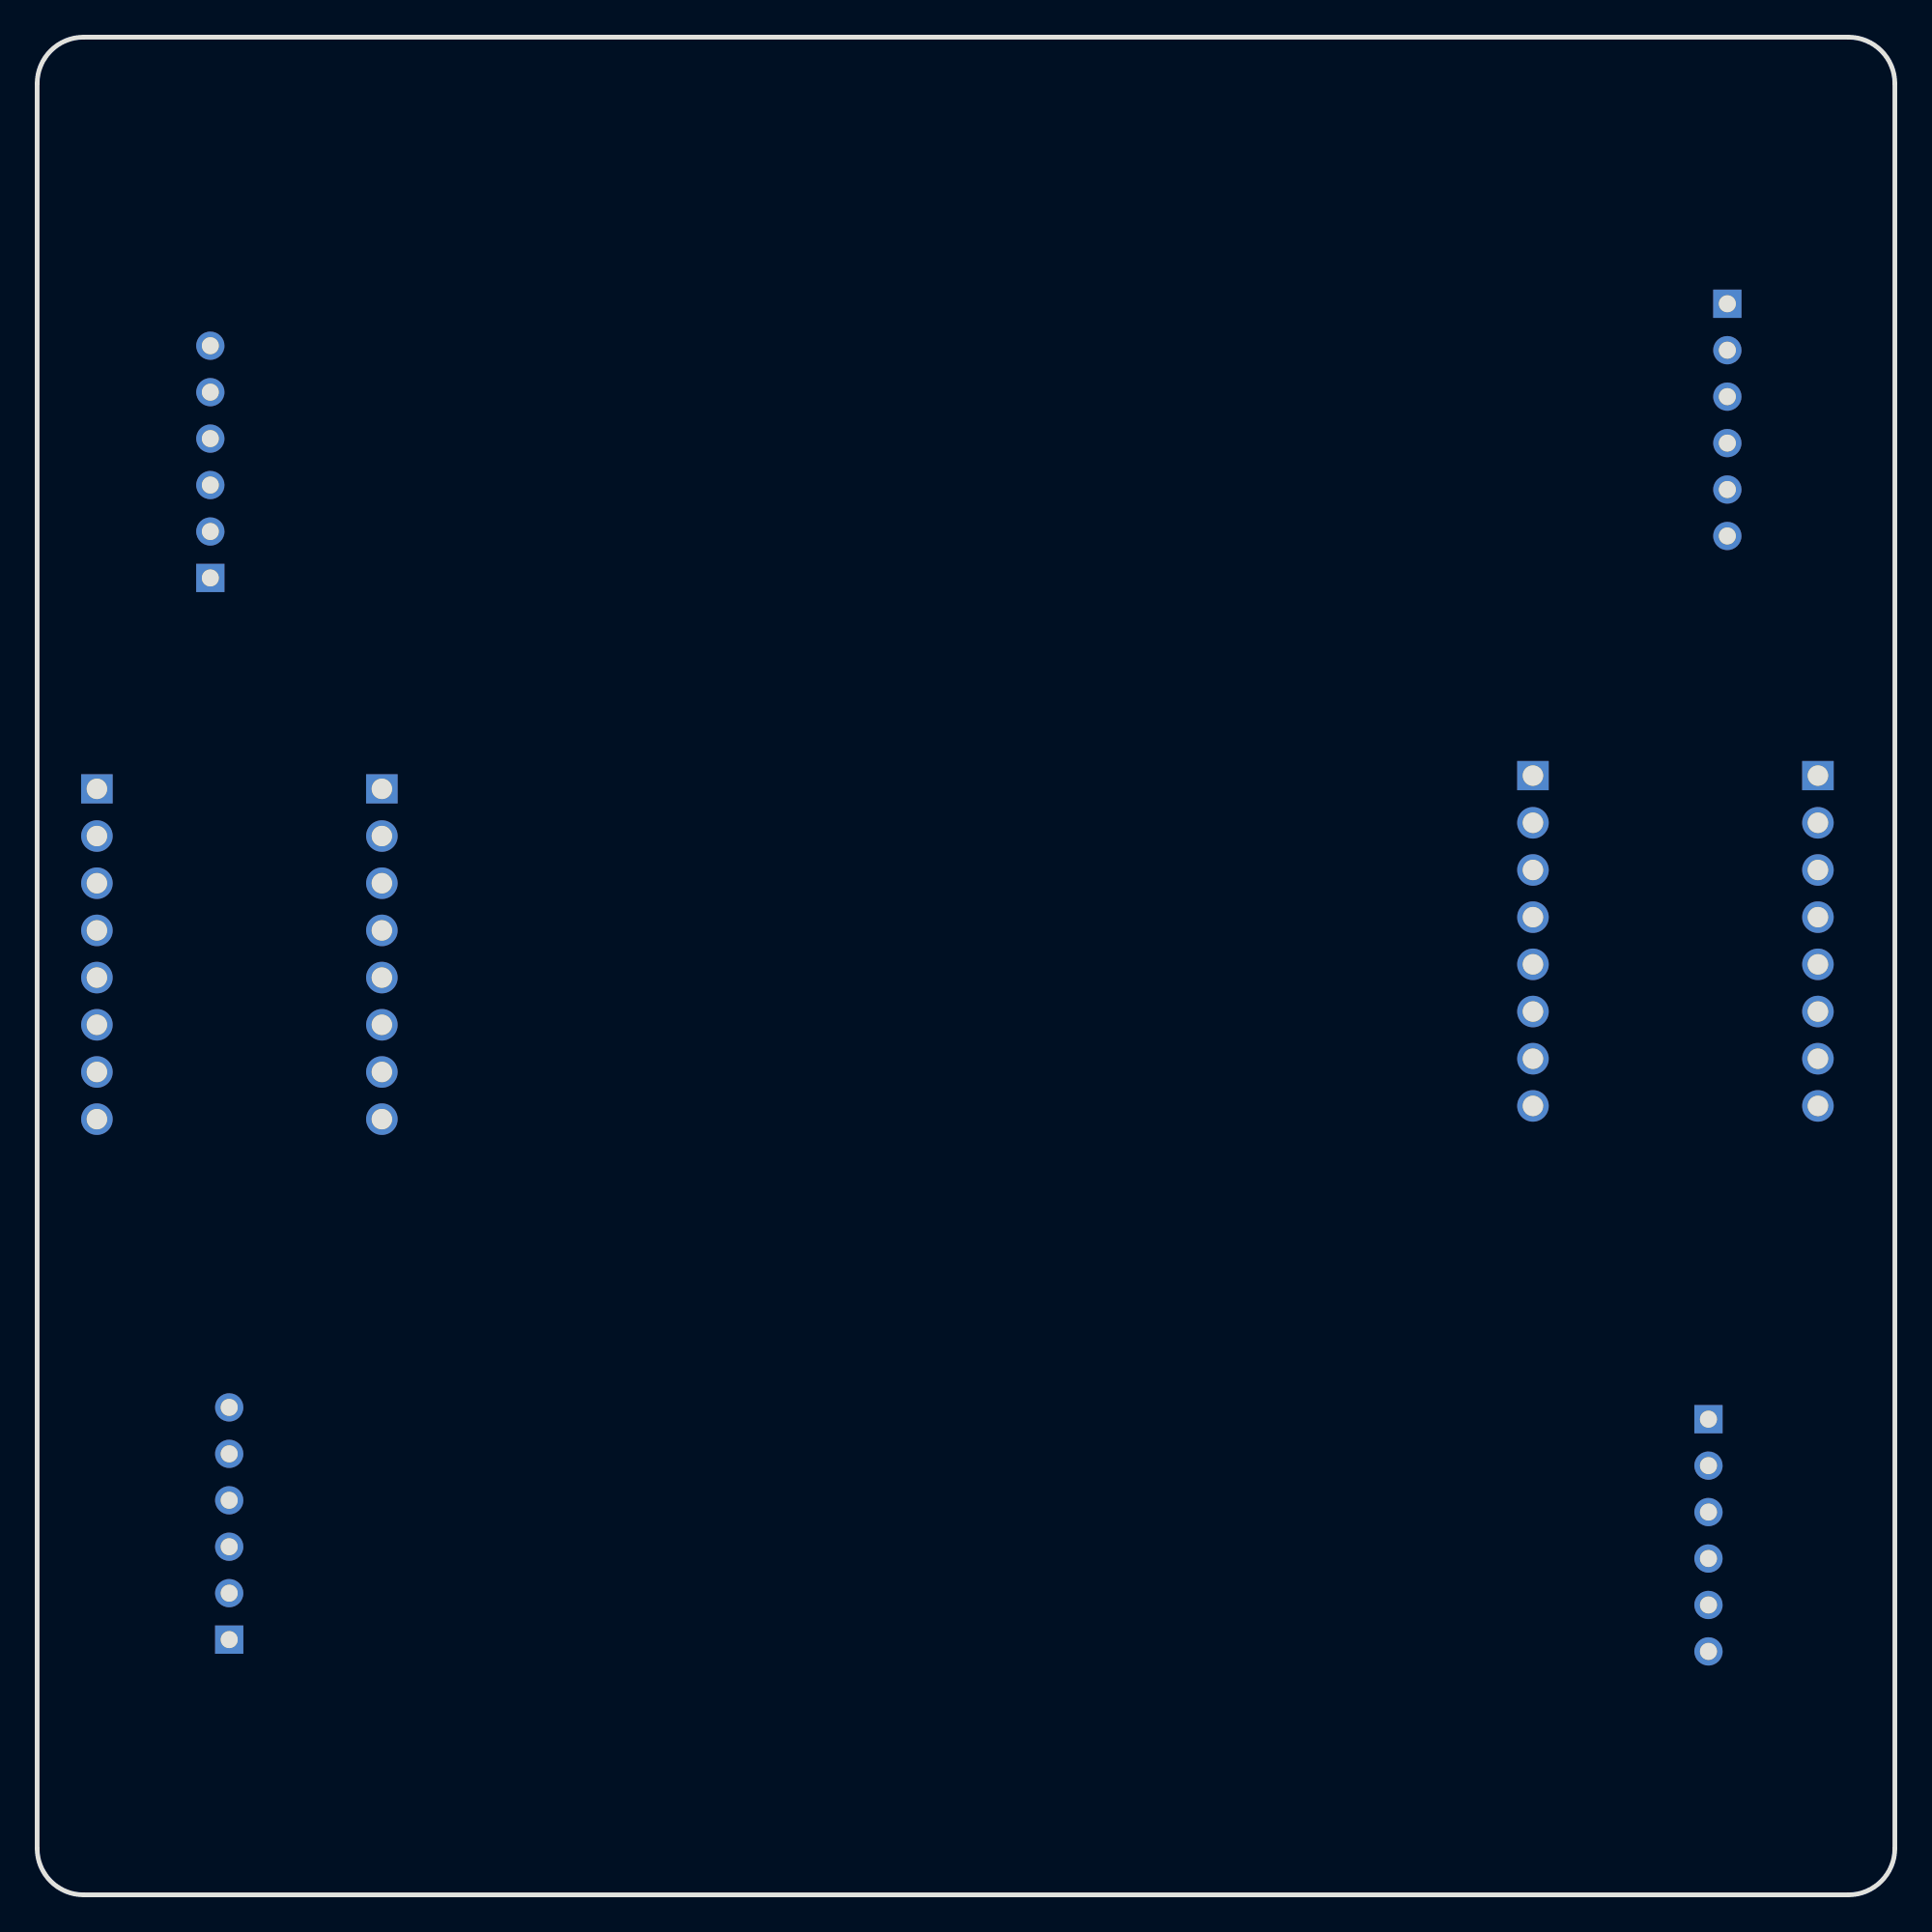
[diagram p6: board, bottom side, seen from below]

Outline 100 x 100 mm; copper layers: Top Layer, Inner9, Inner10, Inner11, Inner12, Inner13, Inner14, Inner15, Inner16, Inner17, Inner18, Inner19, Inner20, Inner21, Inner22, Inner23, Inner24, Inner25, Inner26, Inner27, Inner28, Inner29, Inner30, Bottom Layer. Coordinates in mm from the lower left corner of the outline.
Outline path: 0,97.5 0,2.5 arc(0.73,0.73) 2.5,0 97.5,0 arc(99.27,0.73) 100,2.5 100,97.5 arc(99.27,99.27) 97.5,100 2.5,100 arc(0.73,99.27) 0,97.5
Stack: Top Layer 0.035mm / Dielectric1 1.51mm FR4 er 4.5 / Bottom Layer 0.035mm

## Design rules (mm)
template: JLCPCB Capability(Two Layers Board)
spacing copperThickness1oz (default): track to track 0.102, other pairs 0.152 to 0.3
spacing copperThickness2oz: track to track 0.203, other pairs 0.152 to 0.3
track width copperThickness1oz (default): min 0.127, default 0.254, max 2.54
track width copperThickness2oz: min 0.203, default 0.254, max 2.54
differential pair differentialPair (default): width min 0.127, default 0.254, max 2.54; gap min 0.152, default 0.152
via viaSize (default): diameter min 0.5, default 0.61, max 10; hole min 0.3, default 0.305, max 6.3

## Placement (name value [footprint] x y rotation side)
CN31  电机1  [CONN-TH_6P-P2.50_HC-XH-6AW-G]  9.02 79.4 270 top
CN32  电机2  [CONN-TH_6P-P2.50_HC-XH-6AW-G]  90.68 77.14 90 top
CN33  电机3  [CONN-TH_6P-P2.50_HC-XH-6AW-G]  89.66 19.99 90 top
CN34  电机4  [CONN-TH_6P-P2.50_HC-XH-6AW-G]  10.03 19.35 270 top
U18  TB6612 1  [HDR-TH_8P-P2.54-V-F]  4.14 51.36 270 top
U19  TB6612 1  [HDR-TH_8P-P2.54-V-F]  19.48 51.36 270 top
U20  TB6612 2  [HDR-TH_8P-P2.54-V-F]  81.44 50.65 270 top
U21  TB6612 2  [HDR-TH_8P-P2.54-V-F]  96.78 50.65 270 top

## Footprints (pads in the part's own frame, mm; a bottom-side part is the same pattern mirrored in y, then rotated)
CONN-TH_6P-P2.50_HC-XH-6AW-G
  rect 1.524x1.524 hole 0.914: 1(-6.25,0)
  round 1.524 hole 0.914: 2(-3.75,0) 3(-1.25,0) 4(1.25,0) 5(3.75,0) 6(6.25,0)
HDR-TH_8P-P2.54-V-F
  rect 1.575x1.7 hole 1.1: 1(-8.89,0)
  round 1.7 hole 1.1: 2(-6.35,0) 3(-3.81,0) 4(-1.27,0) 5(1.27,0) 6(3.81,0) 7(6.35,0) 8(8.89,0)

## Nets
3.3V3: U18.2 U19.4 U20.2 U21.4
12V: U18.1 U20.1
GND: U18.3 U18.8 U19.8 U20.3 U20.8 U21.8
AO1: U18.4 U20.4
AO2: U18.5 U20.5
BO1: U18.7 U20.7
BO2: U18.6 U20.6
PA6: U19.1 U21.1
PA7: U19.7 U21.7
PB0: U19.3 U21.3
PB1: U19.2 U21.2
PB8: U19.5 U21.5
PB9: U19.6 U21.6

Pads without a net: CN31 1 2 3 4 5 6; CN32 1 2 3 4 5 6; CN33 1 2 3 4 5 6; CN34 1 2 3 4 5 6
